# EAGLE design SkywireShield_v1.1 (EAGLE 7.7.0)
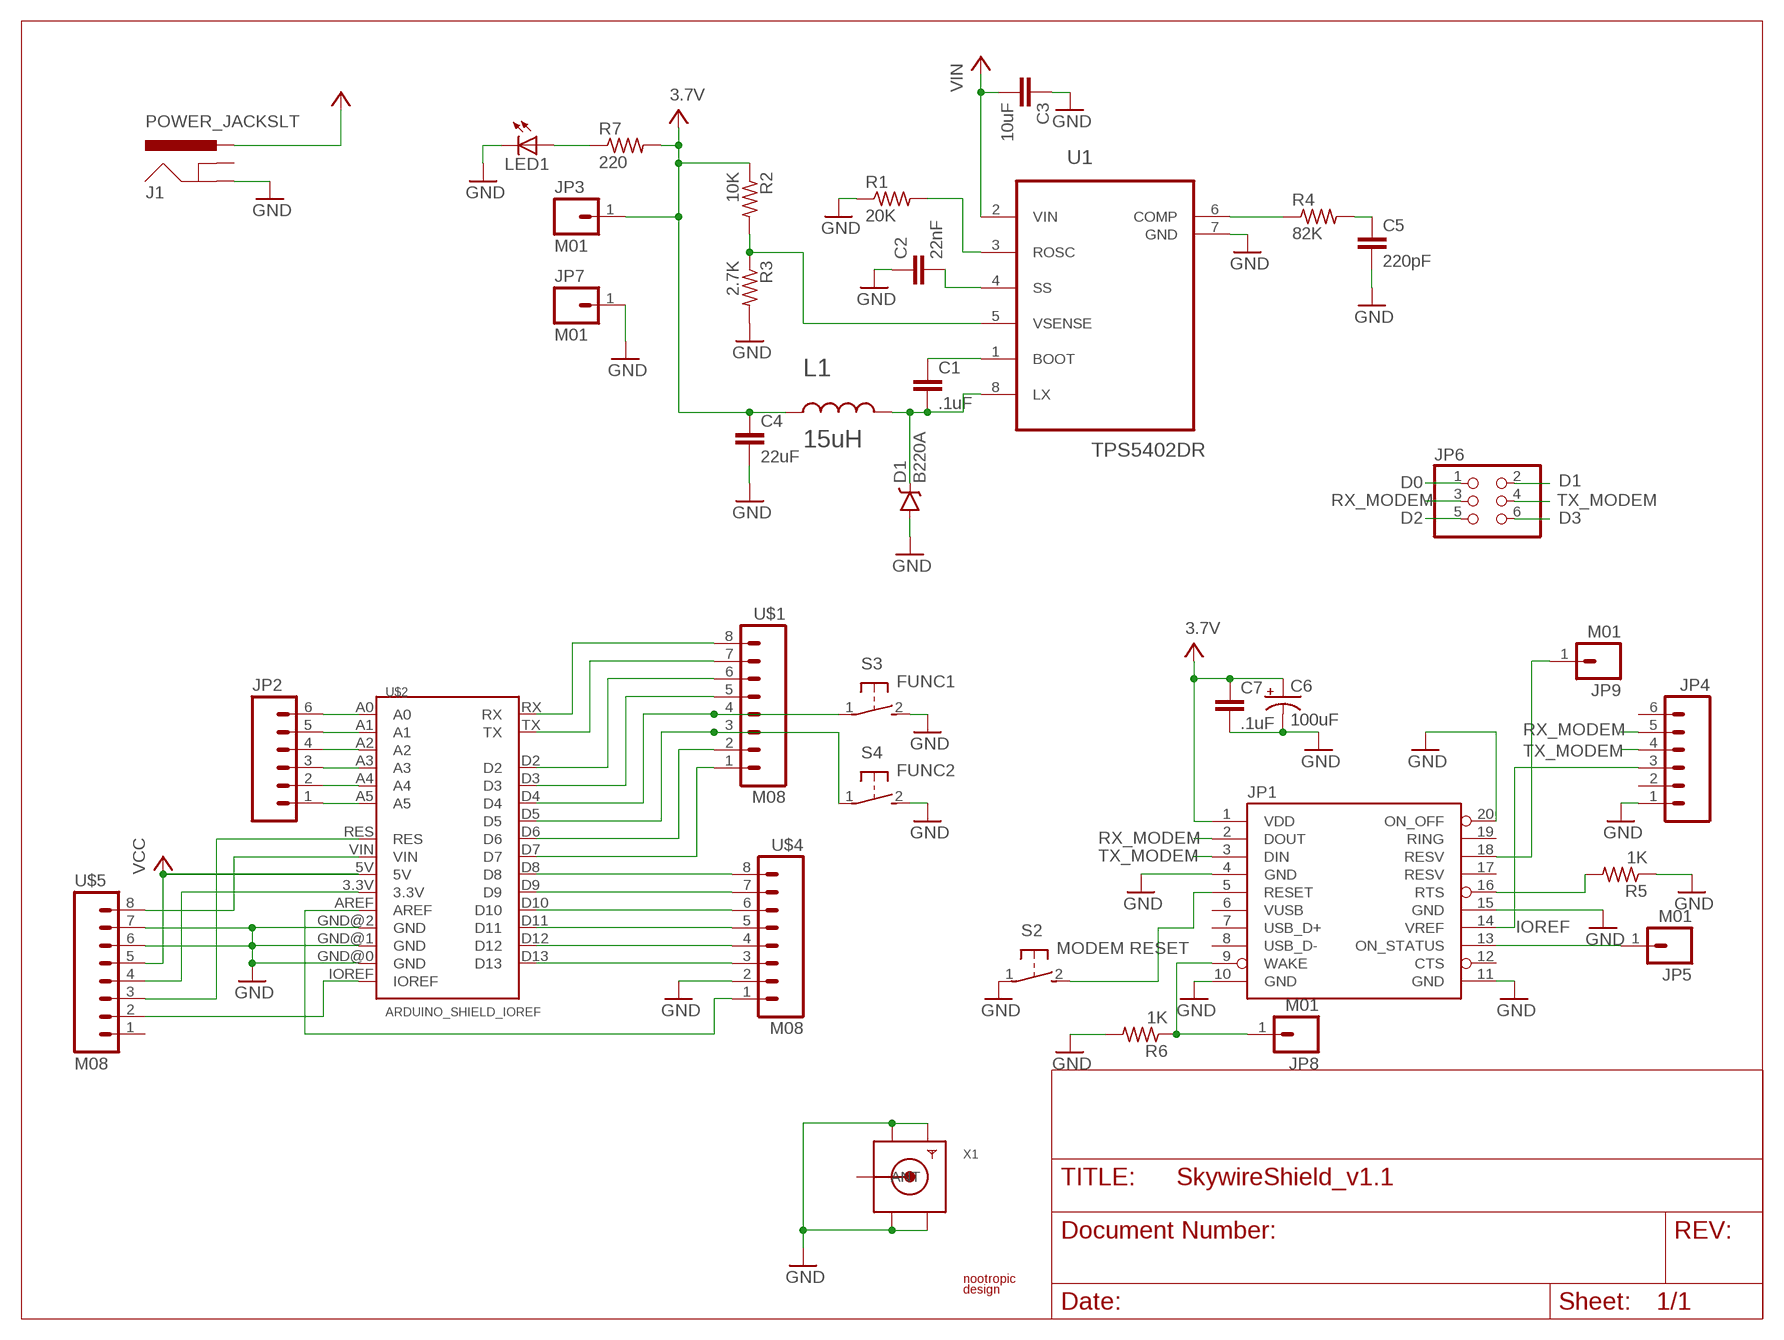
[diagram p0: schematic, sheet 1]

## Parts
C1  .1uF  CAPC0603  [C0603]
C2  22nF  CAPC0603  [C0603]
C3  10uF  CAPC0603  [C0603]
C4  22uF  CAPC0603  [C0603]
C5  220pF  CAPC0603  [C0603]
C6  100uF  CAP-POLSMT-6.3  [PANASONIC_D]
C7  .1uF  CAPC0603  [C0603]
D1  B220A  DIODE-SCHOTTKY-B340A  [SMA-DIODE]
J1  POWER_JACKSLT  [POWER_JACK_SLOT]
JP1  SKYWIRE_MODEM  [SKYWIRE-SOCKET]
JP2  M06  [1X06]
JP3  M01  [1X01]
JP4  M06  [1X06]
JP5  M01  [1X01]
JP6  PINHD-2X3SERIAL-SELECTOR  [2X03-SERIAL-SELECTOR]
JP7  M01  [1X01]
JP8  M01  [1X01]
JP9  M01  [1X01]
L1  15uH  VLS5045EX-CA  [IND_VLS5045EX]
LED1  LEDCHIPLED_0805  [CHIPLED_0805]
R1  20K  R-USR0603  [R0603]
R2  10K  R-USR0603  [R0603]
R3  2.7K  R-USR0603  [R0603]
R4  82K  R-USR0603  [R0603]
R5  1K  R-USR0603  [R0603]
R6  1K  R-USR0603  [R0603]
R7  220  R-USR0603  [R0603]
S2  MODEM RESET  DTSM-3  [DTSM-3]
S3  FUNC1  DTSM-3  [DTSM-3]
S4  FUNC2  DTSM-3  [DTSM-3]
U1  TPS5402DR  [SOIC8]
U$1  M08  [1X08]
U$2  ARDUINO_SHIELD_IOREF  [ARDUINO_SHIELD_GENERIC]
U$3  LOGO  [LOGO_SMALL]
U$4  M08  [1X08]
U$5  M08  [1X08]
X1  SMACONNECTOR  [SMA90_DIP]

## Nets
D0: JP6.1 U$1.8 U$2.RX
D1: JP6.2 U$1.7 U$2.TX
D2: JP6.5 U$1.6 U$2.D2
D3: JP6.6 U$1.5 U$2.D3
D4: S3.1 U$1.4 U$2.D4
D5: S4.1 U$1.3 U$2.D5
D6: U$1.2 U$2.D6
D7: U$1.1 U$2.D7
D8: U$2.D8 U$4.8
FB: R2.2 R3.1 U1.5(VSENSE)
GND: C2.1 C3.1 C4.2 C5.2 C6.- C7.2 D1.A J1.GND JP1.4(GND) JP1.10(GND) JP1.11(GND) JP1.15(GND) JP1.20(ON_OFF) JP4.1 JP7.1 LED1.C R1.1 R3.2 R5.1 R6.2 S2.1 S3.2 S4.2 U1.7(GND) U$2.GND@0(GND) U$2.GND@1(GND) U$2.GND@2(GND) U$4.2 U$5.6 U$5.7 X1.GND1 X1.GND2 X1.GND3 X1.GND4
IOREF: JP1.14(VREF) JP4.3 U$2.IOREF U$5.2
N$1: JP1.18(RESV) JP9.1
N$2: LED1.A R7.1
N$4: JP1.16(RTS) R5.2
N$5: R1.2 U1.3(ROSC)
N$6: C1.1 U1.1(BOOT)
N$7: C1.2 D1.C L1.2 U1.8(LX)
N$8: U$2.3.3V U$5.4
N$9: JP1.5(RESET) S2.2
N$10: U$2.D9 U$4.7
N$11: U$2.D10 U$4.6
N$12: U$2.D11 U$4.5
N$13: U$2.D12 U$4.4
N$14: U$2.D13 U$4.3
N$15: C2.2 U1.4(SS)
N$16: U$2.AREF U$4.1
N$17: JP2.6 U$2.A0
N$18: JP2.5 U$2.A1
N$19: JP2.4 U$2.A2
N$20: JP2.3 U$2.A3
N$21: JP2.2 U$2.A4
N$22: JP2.1 U$2.A5
N$23: U$2.VIN U$5.8
N$24: R4.1 U1.6(COMP)
N$25: C5.1 R4.2
ON_STATUS: JP1.13(ON_STATUS) JP5.1
RESET: U$2.RES U$5.3
RX_MODEM: JP1.2(DOUT) JP4.5 JP6.3
TX_MODEM: JP1.3(DIN) JP4.4 JP6.4
V+: C4.1 C6.+ C7.1 JP1.1(VDD) JP3.1 L1.1 R2.1 R7.2 ; supply symbol labelled 3.7V
VCC: U$2.5V U$5.5
VIN: C3.2 J1.PWR U1.2(VIN)
WAKE: JP1.9(WAKE) JP8.1 R6.1
Unconnected: J1.GNDBREAK JP1.7(USB_D+) JP1.8(USB_D-) JP1.12(CTS) JP1.17(RESV) JP1.19(RING) JP4.2 JP4.6 U$5.1 X1.ANTENNA(ANT)

## Power pins joined to a net without a drawn wire
VUSB: JP1.6(VUSB)

## Library data of the parts
C1-C5 C7 = nootropicdesign:CAP: Unpolarized capacitor
C6 = nootropicdesign:CAP-POL: Capacitor - Polarized, Electrolytic
D1 = SparkFun-DiscreteSemi:DIODE-SCHOTTKY: Schottky diodes in SFE's production catalog BAT20J 1A 23V 0.62Vf RB751 120mA 40V 0.37Vf PMEG4005EJ 0.5A 40V 0.42Vf MBRA140 1A 40V 0.5Vf B340A 3A 40V SMA; PROD_ID: DIO-09886; VALUE: B340A
J1 = nootropicdesign:POWER_JACK: Power Jack This is the standard 5.5mm barrel jack for power. The PTH is the most common, proven, reliable, footprint. The Slot footprint only works if the mill layer is transmitted to the PCB fab house so be warned. Spark Fun Electronics SKU : PRT-00119 SMT: CONN-08106 Mating wall wart : TOL-00298 (and others)
JP1 = nootropicdesign:SKYWIRE_MODEM: Nimbelink Skywire modem
JP2 JP4 = nootropicdesign:M06: 6-pin header
JP3 JP5 JP7-JP9 = nootropicdesign:M01: 2-pin header
JP6 = nootropicdesign:PINHD-2X3: PIN HEADER
L1 = nootropicdesign:VLS5045EX-CA: FIXED IND; AVAILABILITY: Unavailable; DESCRIPTION: Inductor, Wirewound, 4.7uh, 3.2a, 20%; MF: TDK; MP: VLS5045EX; PACKAGE: Nonstandard TDK; PRICE: None
LED1 = nootropicdesign:LED: LED OSRAM: - CHIPLED LG R971, LG N971, LY N971, LG Q971, LY Q971, LO R971, LY R971 LH N974, LH R974 LS Q976, LO Q976, LY Q976 LO Q996 - Hyper CHIPLED LW Q18S LB Q993, LB Q99A, LB R99A - SideLED LS A670, LO A670, LY A670, LG A670, LP A670 LB A673, LV A673, LT A673, LW A673 LH A674 LY A675 LS A676, LA A676, LO A676, LY A676, LW A676 LS A679, LY A679, LG A679 - Hyper Micro SIDELED® LS Y876, LA Y876, LO Y876, LY Y876 LT Y87S - SmartLED LW L88C, LW L88S LB L89C, LB L89S, LG L890 LS L89K, LO L89K, LY L89K LS L896, LA L896, LO L896, LY L896 - TOPLED LS T670, LO T670, LY T670, LG T670, LP T670 LSG T670, LSP T670, LSY T670, LOP T670, LYG T670 LG T671, LOG T671, LSG T671 LB T673, LV T673, LT T673, LW T673 LH T674 LS T676, LA T676, LO T676, LY T676, LB T676, LH T676, LSB T676, LW T676 LB T67C, LV T67C, LT T67C, LS T67K, LO T67K, LY T67K, LW E67C LS E67B, LA E67B, LO E67B, LY E67B, LB E67C, LV E67C, LT E67C LW T67C LS T679, LY T679, LG T679 LS T770, LO T770, LY T770, LG T770, LP T770 LB T773, LV T773, LT T773, LW T773 LH T774 LS E675, LA E675, LY E675, LS T675 LS T776, LA T776, LO T776, LY T776, LB T776 LHGB T686 LT T68C, LB T68C - Hyper Mini TOPLED® LB M676 - Mini TOPLED Santana® LG M470 LS M47K, LO M47K, LY M47K Source: http://www.osram.convergy.de/
R1-R7 = nootropicdesign:R-US: Resistor
S2-S4 = switch-tact:DTSM-3
U1 = nootropicdesign:TPS5402DR: WIDE INPUT RANGE NON-SYNCHRONOUS VOLTAGE MODE CONTROLLER
U$1 U$4 U$5 = nootropicdesign:M08: 8-pin header
U$2 = nootropicdesign:ARDUINO_SHIELD_IOREF
U$3 = nootropicdesign:LOGO
X1 = microbuilder:SMACONNECTOR: SMA Connector 90° DIP SMA Connector, 50 Ohm (4UConnector: 07259)

## Board
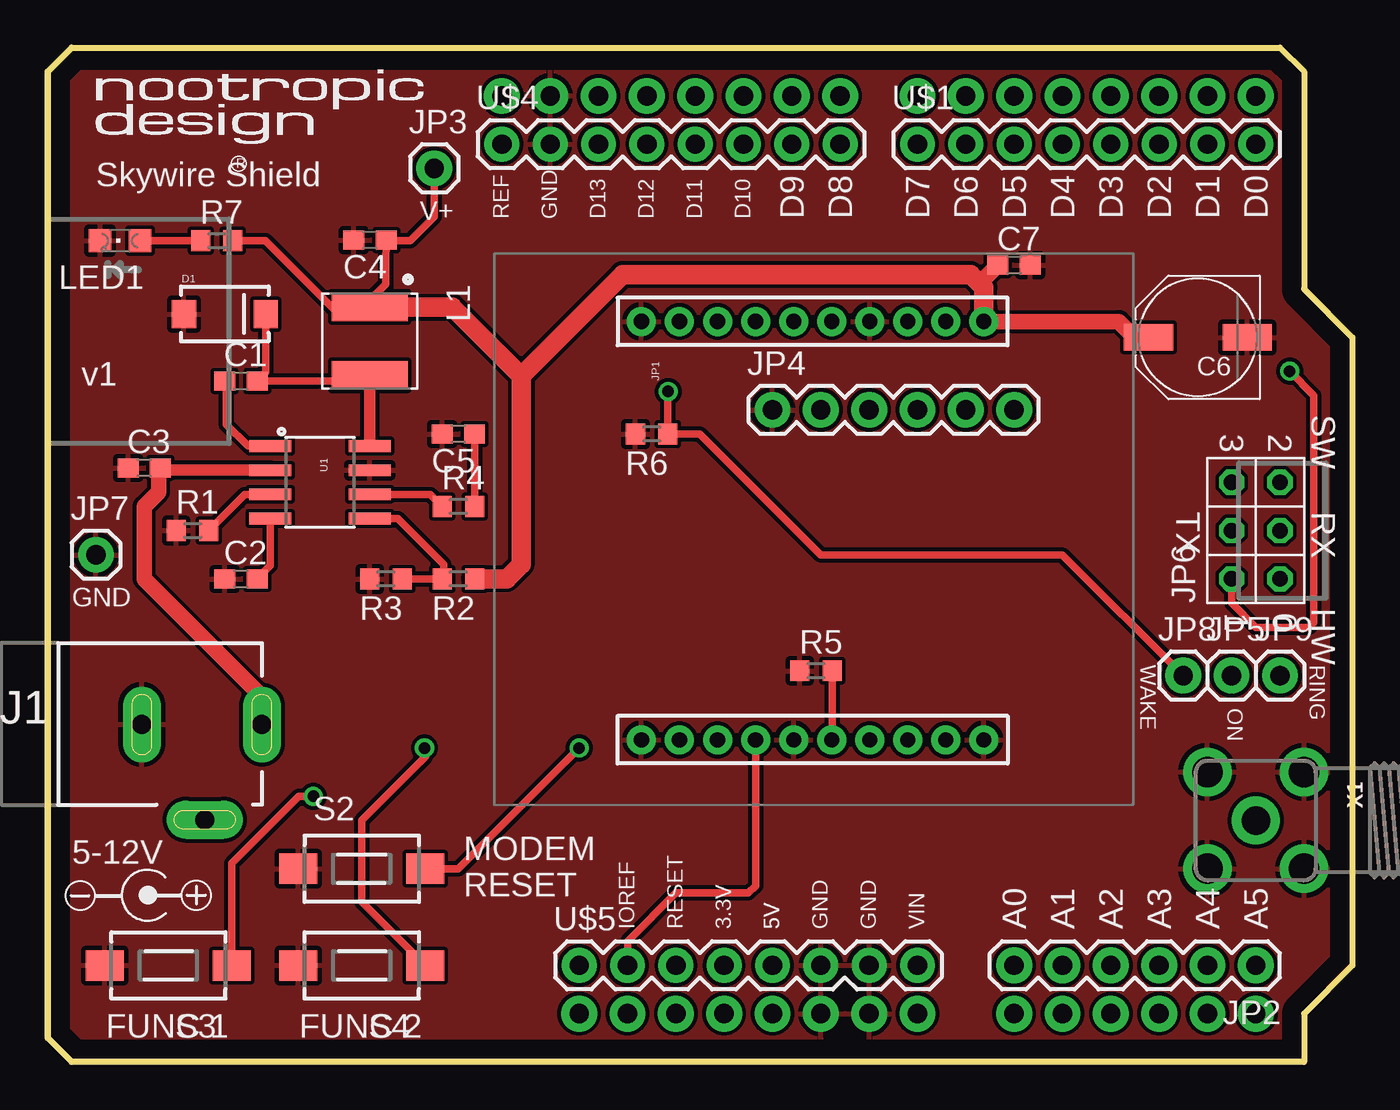
[diagram p1: board, top side]
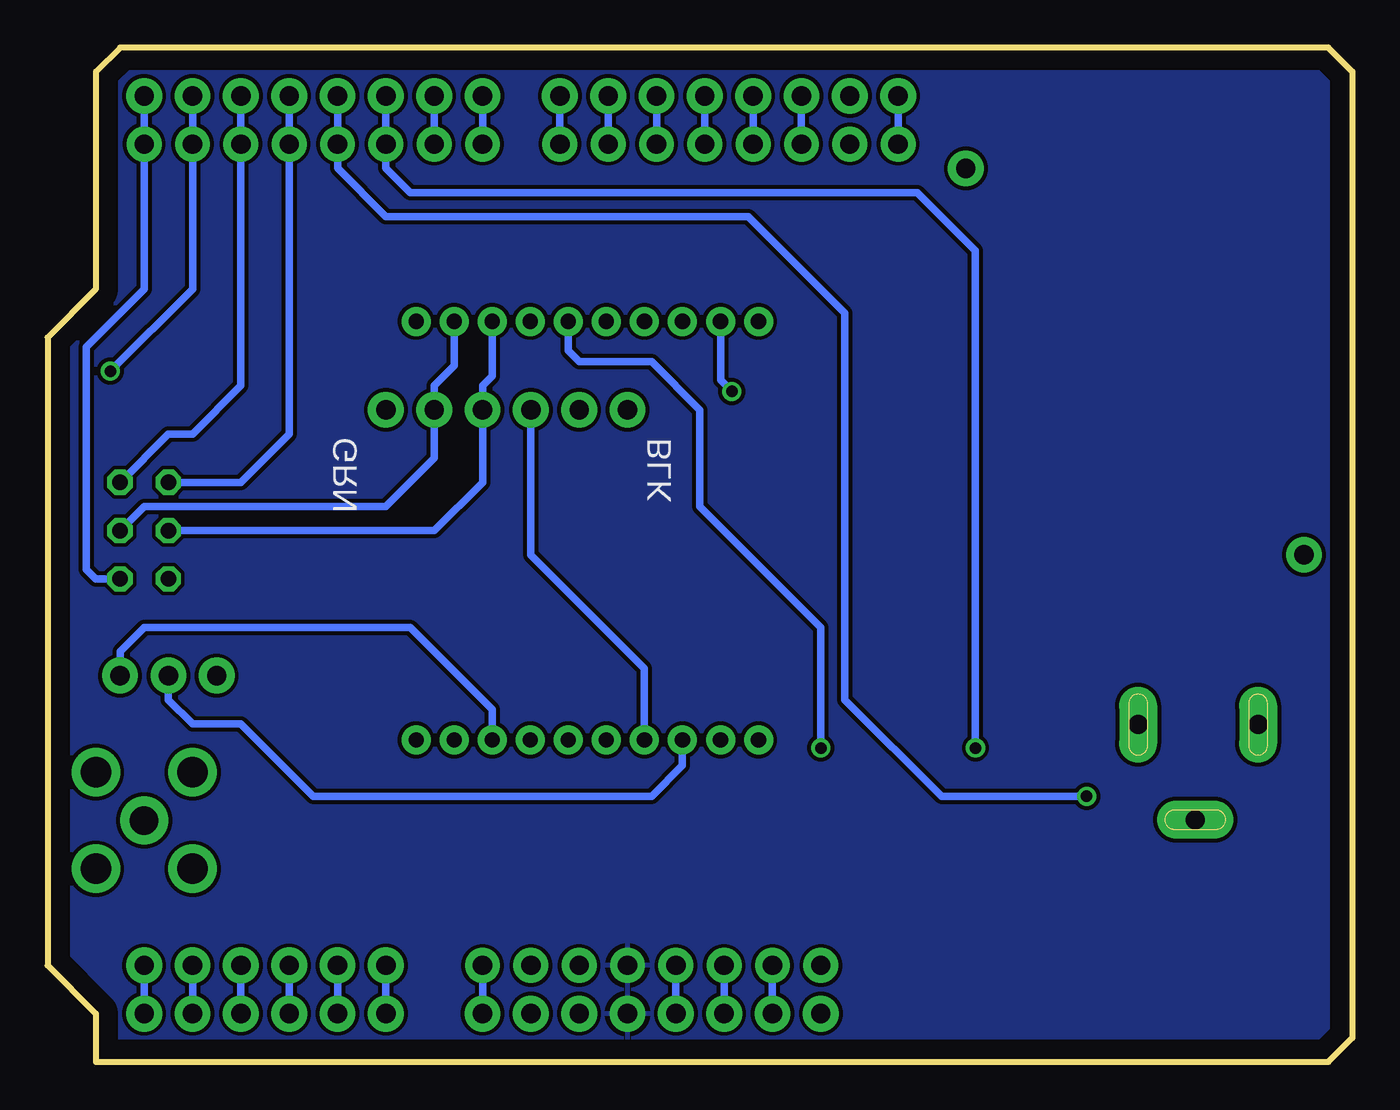
[diagram p2: board, bottom side, seen from below]

Size 68.58 x 53.34 mm. Coordinates in mm from the lower left corner, seen from the top.
Copper layers (1*16): Top 0.035mm / dielectric 1.5mm / Bottom 0.035mm
Design rules "default *": minimum track width 10mil, minimum drill 22mil, track to track 8mil, track to pad 12mil, pad to pad 8mil, via to via 8mil, smd to smd 8mil, copper to edge 40mil, drill to drill 8mil, minimum pad ring 10mil, minimum via ring 8mil, stop-mask expansion 4mil, vias tented up to drill 0mil, thermal gap 10mil

### Footprints (pad centres in the part's own frame; a part is rotated, then mirrored left to right if it is on the bottom)
C0603 = smd 1.1 x 1: 1 -0.85,0; 2 0.85,0
PANASONIC_D = smd 2.6 x 1.4: + 2.6,0; - -2.6,0
SMA-DIODE = smd 1.27 x 1.47: A -2.15,0; C 2.15,0
POWER_JACK_SLOT = drill 1 pad 2 long: GND 0.04,7.5; GNDBREAK 5.04,10.8; PWR 0.04,13.8
SKYWIRE-SOCKET = drill 0.8 pad 1.524: 1 -11,9.84; 2 -11,7.84; 3 -11,5.84; 4 -11,3.84; 5 -11,1.84; 6 -11,-0.16; 7 -11,-2.16; 8 -11,-4.16; 9 -11,-6.16; 10 -11,-8.16; 11 11,-8.16; 12 11,-6.16; 13 11,-4.16; 14 11,-2.16; 15 11,-0.16; 16 11,1.84; 17 11,3.84; 18 11,5.84; 19 11,7.84; 20 11,9.84
1X06 = drill 1.016 pad 1.88: 1 0,0; 2 2.54,0; 3 5.08,0; 4 7.62,0; 5 10.16,0; 6 12.7,0
1X01 = drill 1.016 pad 1.88: 1 0,0
2X03-SERIAL-SELECTOR = drill 0.813 octagon: 1 -2.54,-1.27; 2 -2.54,1.27; 3 0,-1.27; 4 0,1.27; 5 2.54,-1.27; 6 2.54,1.27
IND_VLS5045EX = smd 1.5 x 4: 1 -1.8,0; 2 1.8,0
CHIPLED_0805 = smd 1.2 x 1.2: A 0,-1.05; C 0,1.05
R0603 = smd 1 x 1.1: 1 -0.85,0; 2 0.85,0
DTSM-3 = smd 2 x 1.6: 1 -3.335,0; 2 3.335,0
SOIC8 = smd 0.61 x 2.21: 1 -1.905,-2.616; 2 -0.635,-2.616; 3 0.635,-2.616; 4 1.905,-2.616; 5 1.905,2.616; 6 0.635,2.616; 7 -0.635,2.616; 8 -1.905,2.616
1X08 = drill 1.016 pad 1.829: 1 0,0; 2 2.54,0; 3 5.08,0; 4 7.62,0; 5 10.16,0; 6 12.7,0; 7 15.24,0; 8 17.78,0
ARDUINO_SHIELD_GENERIC = drill 1.016 pad 1.88: 3.3V 35.56,2.54; 5V 38.1,2.54; A0 50.8,2.54; A1 53.34,2.54; A2 55.88,2.54; A3 58.42,2.54; A4 60.96,2.54; A5 63.5,2.54; AREF 23.876,50.8; D2 58.42,50.8; D3 55.88,50.8; D4 53.34,50.8; D5 50.8,50.8; D6 48.26,50.8; D7 45.72,50.8; D8 41.656,50.8; D9 39.116,50.8; D10 36.576,50.8; D11 34.036,50.8; D12 31.496,50.8; D13 28.956,50.8; GND@0 40.64,2.54; GND@1 43.18,2.54; GND@2 26.416,50.8; IOREF 30.48,2.54; NC 27.94,2.54; RES 33.02,2.54; RX 63.5,50.8; TX 60.96,50.8; VIN 45.72,2.54
SMA90_DIP = drill 1.5 pad 2.54: ANTENNA 0,0 | drill 1.6 pad 2.54: GND1 -2.54,2.54; GND2 2.54,2.54; GND3 -2.54,-2.54; GND4 2.54,-2.54

### Placement (x,y rotation side)
C1  10.16,35.81 0 top
C2  10.16,25.4 0 top
C3  5.08,31.24 0 top
C4  16.94,43.22 180 top
C5  21.59,33.02 180 top
C6  60.45,38.1 180 top
C7  50.8,41.91 0 top
D1  9.32,39.33 0 top
J1  -2.54,17.78 270 top
JP1  39.37,27.94 270 top
JP2  63.5,5.08 180 top
JP3  20.32,46.99 0 top
JP4  38.1,34.29 0 top
JP5  62.23,20.32 0 top
JP6  63.5,27.94 90 top
JP7  2.54,26.67 0 top
JP8  59.69,20.32 0 top
JP9  64.77,20.32 0 top
L1  16.94,37.9 270 top
LED1  3.81,43.18 90 top
R1  7.62,27.94 0 top
R2  21.59,25.4 180 top
R3  17.78,25.4 180 top
R4  21.59,29.21 0 top
R5  40.39,20.57 0 top
R6  31.75,33.02 180 top
R7  8.89,43.18 0 top
S2  16.51,10.16 0 top
S3  6.35,5.08 180 top
S4  16.51,5.08 180 top
U1  14.32,30.48 270 top
U$1  45.72,48.26 0 top
U$2  0,0 0 top
U$3  2.54,48.26 0 top
U$4  23.88,48.26 0 top
U$5  27.94,5.08 0 top
X1  63.5,12.7 270 top

### Tracks (layer width: path | path; a pad name or v marks a point on that pad's centre or on a via)
D0
  Bottom 0.406: JP6.1 66.04,25.4 66.55,25.91 66.55,37.59 63.5,40.64 U$1.8 U$2.RX
D1  (via drill 0.6)
  Top 0.406: JP6.2 62.23,24.13 63.5,22.86 66.29,22.86 66.55,23.11 66.55,35.05 v65.28,36.32
  Bottom 0.406: v65.28,36.32 60.96,40.64 U$1.7 U$2.TX
D2
  Bottom 0.406: JP6.5 62.23,33.02 60.96,33.02 58.42,35.56 U$1.6 U$2.D2
D3
  Bottom 0.406: JP6.6 58.42,30.48 55.88,33.02 U$1.5 U$2.D3
D4  (via drill 0.6)
  Top 0.406: S3.1 9.69,10.45 13.21,13.97 v13.97,13.97
  Bottom 0.406: U$2.D4 U$1.4 53.34,46.99 50.8,44.45 31.75,44.45 26.67,39.37 26.67,19.05 21.59,13.97 v13.97,13.97
D5  (via drill 0.6)
  Top 0.406: v19.81,16.51 19.84,16.48 19.84,16.04 16.51,12.7 16.51,8.41 S4.1
  Bottom 0.406: v19.81,16.51 19.81,42.67 22.86,45.72 49.53,45.72 50.8,46.99 U$1.3 U$2.D5
D6
  Bottom 0.406: U$2.D6 U$1.2
D7
  Bottom 0.406: U$1.1 U$2.D7
D8
  Bottom 0.406: U$2.D8 U$4.8
FB
  Top 0.406: U1.5 18.41,28.57 20.83,26.16 20.83,25.49 R2.2 R3.1
GND
  pour Top: 0.38,51.94 1.4,52.96 64.64,52.96 65.66,51.94 65.66,40.51 68.2,37.97 68.2,5.21 65.66,2.67 65.66,0.38 1.4,0.38 0.38,1.4
IOREF
  Top 0.406: JP1.14 37.21,9.27 36.83,8.89 33.02,8.89 30.48,6.35 U$5.2
  Bottom 0.406: U$2.IOREF U$5.2 | JP4.3 43.18,26.67 37.21,20.7 JP1.14
N$1
  Bottom 0.406: JP1.18 45.21,18.54 49.53,22.86 63.5,22.86 64.77,21.59 JP9.1
N$2
  Top 0.406: LED1.A R7.1
N$4
  Top 0.406: R5.2 41.24,16.97 JP1.16
N$5
  Top 0.406: U1.3 10.38,29.84 R1.2
N$6
  Top 0.406: U1.1 10.54,32.38 9.4,33.53 9.4,35.73 C1.1
N$7
  Top 0.406: L1.2 16.94,35.56 16.51,35.56 16.26,35.81 C1.2 11.47,36.27 D1.C
  Top 0.61: U1.8 16.94,35.56
N$8
  Bottom 0.406: U$2.3.3V U$5.4
N$9  (via drill 0.6)
  Top 0.406: S2.2 21.59,10.16 v27.94,16.51
  Bottom 0.406: JP1.5 41.21,37.4 40.64,36.83 36.83,36.83 34.29,34.29 34.29,29.21 27.94,22.86 v27.94,16.51
N$10
  Bottom 0.406: U$4.7 U$2.D9
N$11
  Bottom 0.406: U$2.D10 U$4.6
N$12
  Bottom 0.406: U$4.5 U$2.D11
N$13
  Bottom 0.406: U$2.D12 U$4.4
N$14
  Bottom 0.406: U$4.3 U$2.D13
N$15
  Top 0.406: U1.4 11.7,26.09 C2.2
N$16
  Bottom 0.406: U$4.1 U$2.AREF
N$17
  Bottom 0.406: JP2.6 U$2.A0
N$18
  Bottom 0.406: JP2.5 U$2.A1
N$19
  Bottom 0.406: JP2.4 U$2.A2
N$20
  Bottom 0.406: JP2.3 U$2.A3
N$21
  Bottom 0.406: JP2.2 U$2.A4
N$22
  Bottom 0.406: JP2.1 U$2.A5
N$23
  Bottom 0.406: U$5.8 U$2.VIN
N$24
  Top 0.406: U1.6 20.11,29.84 R4.1
N$25
  Top 0.406: R4.2 C5.1
ON_STATUS
  Bottom 0.406: JP1.13 35.21,15.59 36.83,13.97 54.61,13.97 58.42,17.78 60.96,17.78 62.23,19.05 JP5.1
RESET
  Bottom 0.406: U$5.3 U$2.RES
RX_MODEM
  Bottom 0.406: JP1.2 47.21,36.61 48.26,35.56 JP4.5 48.26,31.75 50.8,29.21 63.5,29.21 JP6.3
TX_MODEM
  Bottom 0.406: JP1.3 45.21,36.07 45.72,35.56 JP4.4 45.72,30.48 48.26,27.94 JP6.4
V+
  Top 0.406: C6.+ 57.15,38.1 | JP3.1 20.32,44.45 19.05,43.18 17.83,43.18 C4.1 17.78,41.94 17.78,40.89 16.94,40.05 L1.1 16.61,39.37 15.24,39.37 11.43,43.18 R7.2
  Top 0.813: JP1.1 56.31,38.94 57.15,38.1 | 49.21,39.69 49.21,41.17 C7.1
  Top 1.016: L1.1 21.26,39.7 24.89,36.07 | 24.89,36.07 24.89,26.16 24.13,25.4 R2.1 | JP1.1 49.21,39.69 49.21,40.71 48.51,41.4 30.23,41.4 24.89,36.07
VCC
  pour Bottom: 1.4,0.38 0.38,1.4 0.38,51.94 1.4,52.96 64.64,52.96 65.66,51.94 65.66,40.51 68.2,37.97 68.2,5.21 65.66,2.67 65.66,0.38
VIN
  Top 0.61: U1.2 6.06,31.11 C3.2
  Top 0.813: C3.2 5.84,31.15 5.84,29.97 5.08,29.21 5.08,25.4 11.26,19.22 J1.PWR
WAKE  (via drill 0.6)
  Top 0.406: v32.61,35.26 32.6,35.24 R6.1 34.29,33.02 40.64,26.67 53.34,26.67 JP8.1
  Bottom 0.406: JP1.9 33.21,35.85 v32.61,35.26

### Text on the board
tPlace: R | Skywire Shield | V+ | v1 | SW | 3 | 2 | TX | RX | GND | 1 | 0 | HW | WAKE | RING | ON | MODEM | 5-12V | RESET | FUNC 1 | FUNC 2
bPlace: BLK | GRN